# EAGLE design brelok (EAGLE 8.3.2)
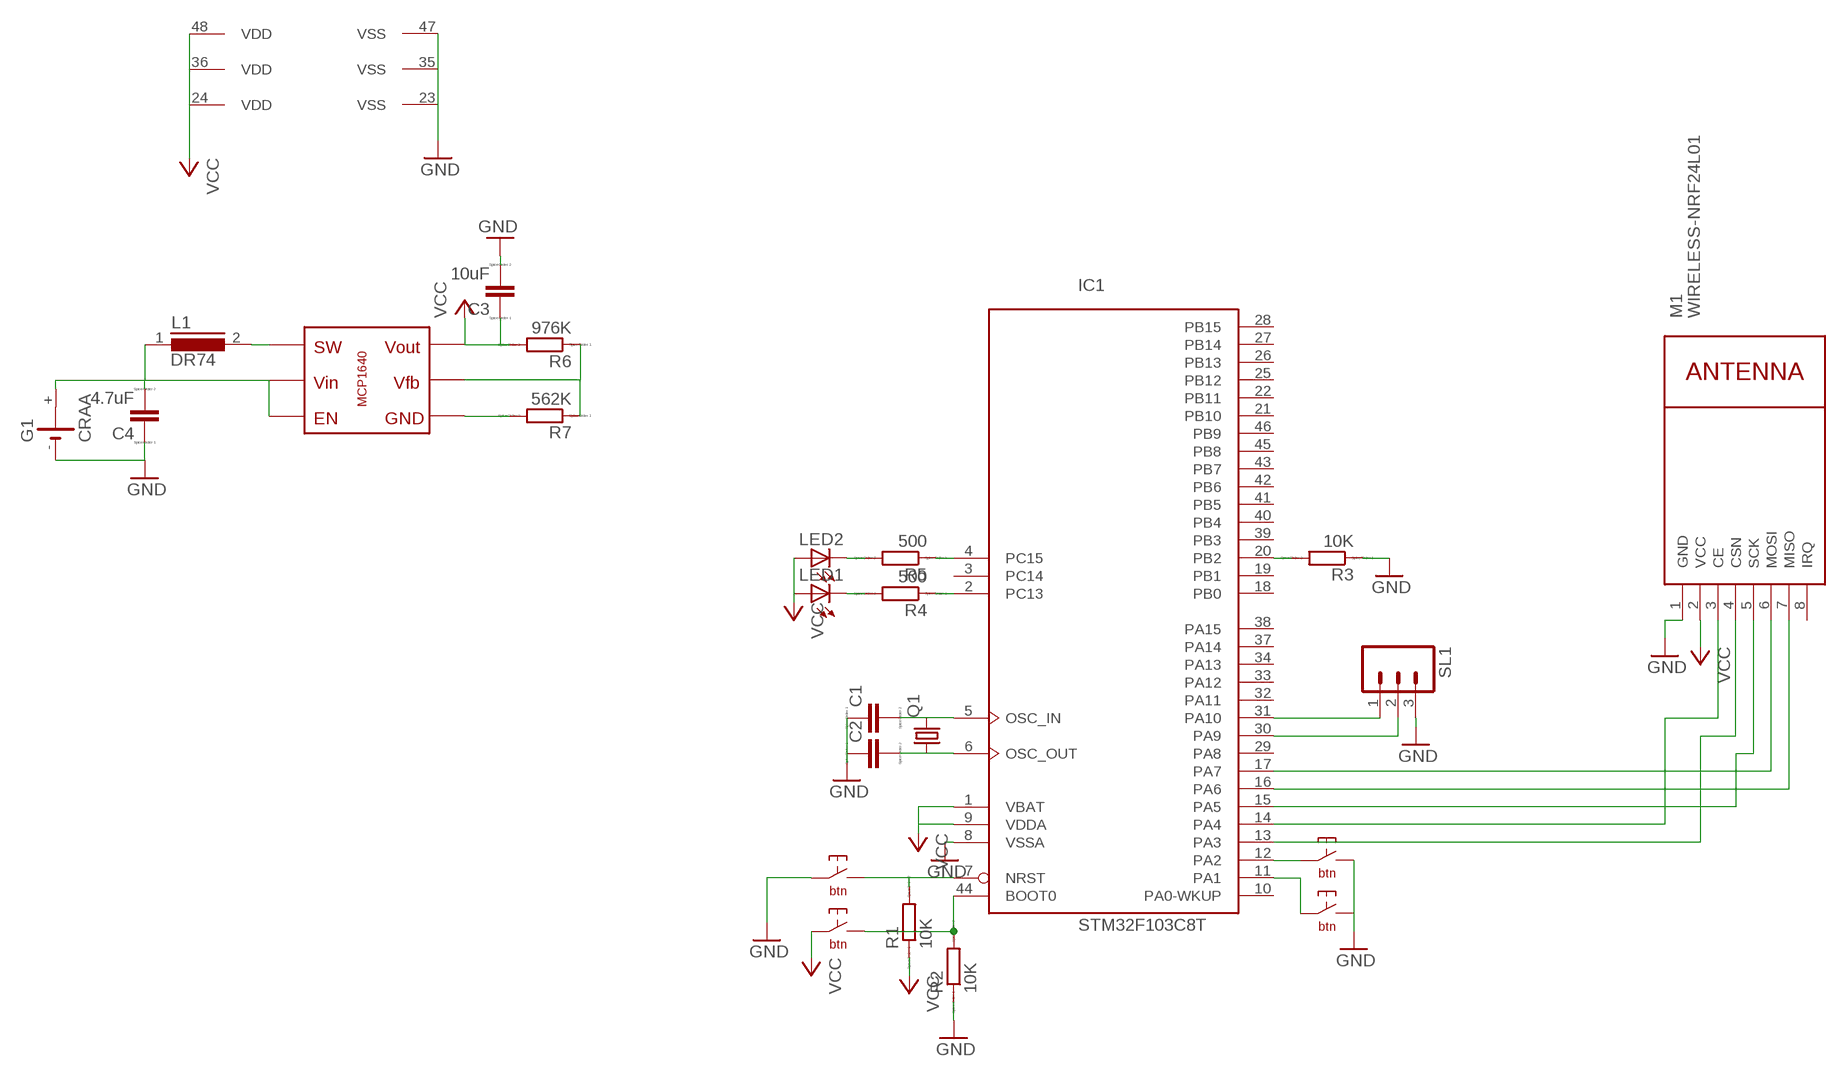
[diagram p0: schematic, sheet 1]

## Parts
BOOT  TM1103  [TM1103]
C1  CC0504  [C0504]
C2  CC0504  [C0504]
C3  10uF  CC0504  [C0504]
C4  4.7uF  CC0504  [C0504]
G1  CRAA  [CRAA]
IC1  STM32F103C8T  [LQFP48]
L1  DR74  [DR74]
LED1  LEDCHIP-LED0805  [CHIP-LED0805]
LED2  LEDCHIP-LED0805  [CHIP-LED0805]
M1  WIRELESS-NRF24L01  [WIRELESS-NRF24L01]
Q1  CRYSTALHC49UP  [HC49UP]
R1  10K  R  [R0805]
R2  10K  R  [R0805]
R3  10K  R  [R0805]
R4  500  R  [R0805]
R5  500  R  [R0805]
R6  976K  R  [R0805]
R7  562K  R  [R0805]
RESET  TM1103  [TM1103]
RESET1  TM1103  [TM1103]
RESET2  TM1103  [TM1103]
SL1  M03  [03P]
U$1  MCP1640  [SOT23-6]

## Nets
GND: C1.1 C2.1 C3.2 C4.1 G1.- IC1.8(VSSA) IC1.23(VSS) IC1.35(VSS) IC1.47(VSS) M1.1(GND) R2.1 R3.1 RESET1.P$1 RESET2.P$1 RESET.P$2 SL1.3
N$1: IC1.17(PA7) M1.6(MOSI)
N$2: IC1.16(PA6) M1.7(MISO)
N$3: IC1.15(PA5) M1.5(SCK)
N$4: IC1.14(PA4) M1.3(CE)
N$5: IC1.13(PA3) M1.4(CSN)
N$6: C1.2 IC1.5(OSC_IN) Q1.2
N$7: C2.2 IC1.6(OSC_OUT) Q1.1
N$8: IC1.7(NRST) R1.2 RESET.P$1
N$9: BOOT.P$1 IC1.44(BOOT0) R2.2
N$10: IC1.31(PA10) SL1.1
N$11: IC1.20(PB2) R3.2
N$12: IC1.30(PA9) SL1.2
N$13: LED1.C R4.2
N$14: LED2.C R5.2
N$15: IC1.4(PC15) R5.1
N$16: IC1.2(PC13) R4.1
N$17: L1.2 U$1.1(SW)
N$18: IC1.12(PA2) RESET1.P$2
N$19: IC1.11(PA1) RESET2.P$2
N$20: C4.2 G1.+ L1.1 U$1.3(EN) U$1.6(VIN)
N$22: C3.1 R6.2 U$1.5(VOUT)
N$23: R6.1 R7.1 U$1.4(VFB)
N$24: R7.2 U$1.2(GND)
VCC: BOOT.P$2 IC1.1(VBAT) IC1.9(VDDA) IC1.24(VDD) IC1.36(VDD) IC1.48(VDD) LED1.A LED2.A M1.2(VCC) R1.1
Unconnected: G1.+@1(+) IC1.3(PC14) IC1.10(PA0-WKUP) IC1.18(PB0) IC1.19(PB1) IC1.21(PB10) IC1.22(PB11) IC1.25(PB12) IC1.26(PB13) IC1.27(PB14) IC1.28(PB15) IC1.29(PA8) IC1.32(PA11) IC1.33(PA12) IC1.34(PA13) IC1.37(PA14) IC1.38(PA15) IC1.39(PB3) IC1.40(PB4) IC1.41(PB5) IC1.42(PB6) IC1.43(PB7) IC1.45(PB8) IC1.46(PB9) M1.8(IRQ)

## Library data of the parts
BOOT RESET RESET1 RESET2 = tm1103:TM1103
C1-C4 = eagle-ltspice:C: CAPACITOR, European symbol; SPICEMODEL: NONE; SPICEPREFIX: C
G1 = battery:CRAA: LI BATTERY Varta
IC1 = micro-stm_v2:STM32F103C*T: ARM 32-bit Cortex™-M3 CPU 72 MHz maximum frequency 16 to 128 Kbytes of Flash memory 6 to 20 kbytes of SRAM 37 GPIOs 2.0 to 3.6 V application supply
L1 = inductors:DR74: High Power Density, High Efficiency, Shielded Inductors Source: coiltronics_dr_series.pdf
LED1 LED2 = led:LED: LED OSRAM: - CHIPLED LG R971, LG N971, LY N971, LG Q971, LY Q971, LO R971, LY R971 LH N974, LH R974 LS Q976, LO Q976, LY Q976 LO Q996 - Hyper CHIPLED LW Q18S LB Q993, LB Q99A, LB R99A - SideLED LS A670, LO A670, LY A670, LG A670, LP A670 LB A673, LV A673, LT A673, LW A673 LH A674 LY A675 LS A676, LA A676, LO A676, LY A676, LW A676 LS A679, LY A679, LG A679 - Hyper Micro SIDELED® LS Y876, LA Y876, LO Y876, LY Y876 LT Y87S - SmartLED LW L88C, LW L88S LB L89C, LB L89S, LG L890 LS L89K, LO L89K, LY L89K LS L896, LA L896, LO L896, LY L896 - TOPLED LS T670, LO T670, LY T670, LG T670, LP T670 LSG T670, LSP T670, LSY T670, LOP T670, LYG T670 LG T671, LOG T671, LSG T671 LB T673, LV T673, LT T673, LW T673 LH T674 LS T676, LA T676, LO T676, LY T676, LB T676, LH T676, LSB T676, LW T676 LB T67C, LV T67C, LT T67C, LS T67K, LO T67K, LY T67K, LW E67C LS E67B, LA E67B, LO E67B, LY E67B, LB E67C, LV E67C, LT E67C LW T67C LS T679, LY T679, LG T679 LS T770, LO T770, LY T770, LG T770, LP T770 LB T773, LV T773, LT T773, LW T773 LH T774 LS E675, LA E675, LY E675, LS T675 LS T776, LA T776, LO T776, LY T776, LB T776 LHGB T686 LT T68C, LB T68C - Hyper Mini TOPLED® LB M676 - Mini TOPLED Santana® LG M470 LS M47K, LO M47K, LY M47K Source: http://www.osram.convergy.de LUXEON: - LUMILED® LXK2-PW12-R00, LXK2-PW12-S00, LXK2-PW14-U00, LXK2-PW14-V00 LXK2-PM12-R00, LXK2-PM12-S00, LXK2-PM14-U00 LXK2-PE12-Q00, LXK2-PE12-R00, LXK2-PE12-S00, LXK2-PE14-T00, LXK2-PE14-U00 LXK2-PB12-K00, LXK2-PB12-L00, LXK2-PB12-M00, LXK2-PB14-N00, LXK2-PB14-P00, LXK2-PB14-Q00 LXK2-PR12-L00, LXK2-PR12-M00, LXK2-PR14-Q00, LXK2-PR14-R00 LXK2-PD12-Q00, LXK2-PD12-R00, LXK2-PD12-S00 LXK2-PH12-R00, LXK2-PH12-S00 LXK2-PL12-P00, LXK2-PL12-Q00, LXK2-PL12-R00 Source: www.luxeon.com KINGBRIGHT: KA-3528ASYC Source: www.kingbright.com
M1 = diy-modules:WIRELESS-NRF24L01: 2.4 GHz Wireless Module based on NRF24L01 chip More details available here: http://www.electrodragon.com/w/NRF24L01 Click here to find device on ebay.com <http://www.ebay.com/sch/nrf24l01+arduino>
Q1 = crystal:CRYSTAL: CRYSTAL; OC_FARNELL: unknown; OC_NEWARK: unknown
R1-R7 = eagle-ltspice:R: RESISTOR, European symbol; SPICEMODEL: NONE; SPICEPREFIX: R
SL1 = con-amp-quick:M03: AMP QUICK CONNECTOR; OC_FARNELL: unknown; OC_NEWARK: unknown
U$1 = mcp1640:MCP1640

## Board
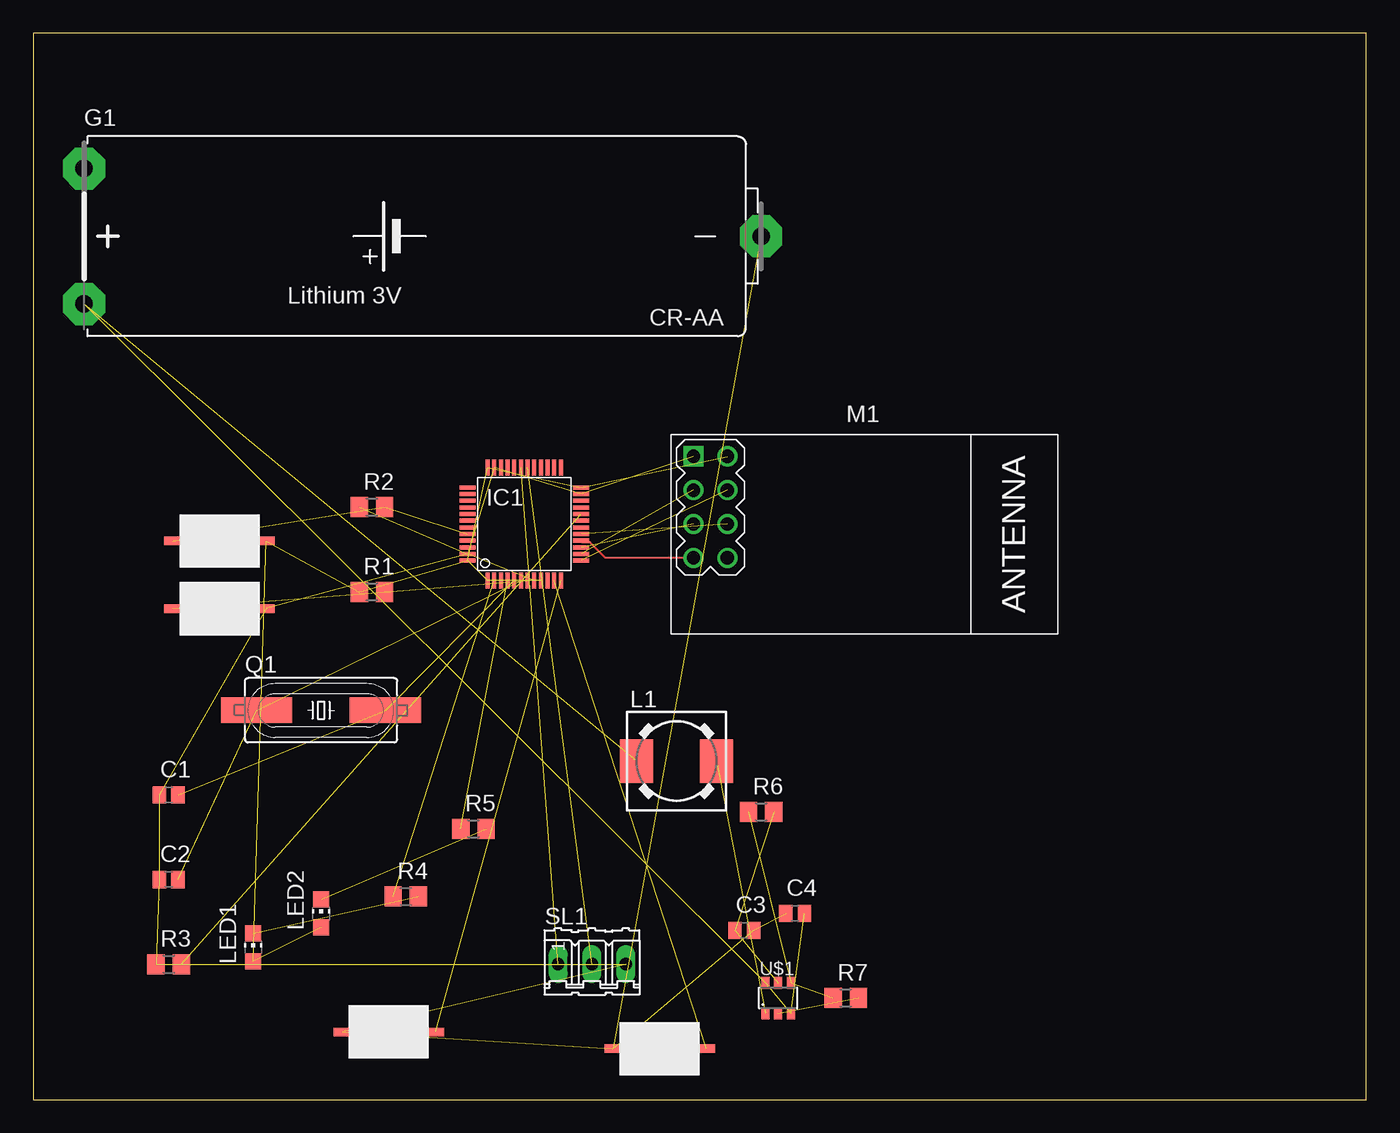
[diagram p1: board, top side]

Size 100 x 80 mm. Coordinates in mm from the lower left corner, seen from the top.
Outline: 0,0 100,0 100,80 0,80 0,0
Copper layers (1*16): Top 0.035mm / dielectric 1.5mm / Bottom 0.035mm
Design rules "default": minimum track width 6mil, minimum drill 0.35mm, track to track 6mil, track to pad 6mil, pad to pad 6mil, via to via 6mil, smd to smd 6mil, copper to edge 40mil, drill to drill 6mil, minimum pad ring 10mil, minimum via ring 8mil, stop-mask expansion 4mil, vias tented up to drill 0mil, thermal gap 10mil

### Footprints (pad centres in the part's own frame; a part is rotated, then mirrored left to right if it is on the bottom)
TM1103 = smd 1.27 x 0.635: P$1 -3.5,0; P$2 3.5,0
C0504 = smd 1 x 1.3: 1 -0.7,0; 2 0.7,0
CRAA = drill 1.321 pad 3.15 octagon: + -25.4,-5.08; +@1 -25.4,5.08; - 25.4,0
LQFP48 = smd 0.3 x 1.2: 1 -2.75,-4.25; 2 -2.25,-4.25; 3 -1.75,-4.25; 4 -1.25,-4.25; 5 -0.75,-4.25; 6 -0.25,-4.25; 7 0.25,-4.25; 8 0.75,-4.25; 9 1.25,-4.25; 10 1.75,-4.25; 11 2.25,-4.25; 12 2.75,-4.25; 25 2.75,4.25; 26 2.25,4.25; 27 1.75,4.25; 28 1.25,4.25; 29 0.75,4.25; 30 0.25,4.25; 31 -0.25,4.25; 32 -0.75,4.25; 33 -1.25,4.25; 34 -1.75,4.25; 35 -2.25,4.25; 36 -2.75,4.25 | smd 1.2 x 0.3: 13 4.25,-2.75; 14 4.25,-2.25; 15 4.25,-1.75; 16 4.25,-1.25; 17 4.25,-0.75; 18 4.25,-0.25; 19 4.25,0.25; 20 4.25,0.75; 21 4.25,1.25; 22 4.25,1.75; 23 4.25,2.25; 24 4.25,2.75; 37 -4.25,2.75; 38 -4.25,2.25; 39 -4.25,1.75; 40 -4.25,1.25; 41 -4.25,0.75; 42 -4.25,0.25; 43 -4.25,-0.25; 44 -4.25,-0.75; 45 -4.25,-1.25; 46 -4.25,-1.75; 47 -4.25,-2.25; 48 -4.25,-2.75
DR74 = smd 2.5 x 3.25: 1 -3,0; 2 3,0
CHIP-LED0805 = smd 1.2 x 1.2: A 0,-1.05; C 0,1.05
WIRELESS-NRF24L01 = drill 1 square: 1 -12.7,6.35 | drill 1: 2 -10.16,6.35; 3 -12.7,3.81; 4 -10.16,3.81; 5 -12.7,1.27; 6 -10.16,1.27; 7 -12.7,-1.27; 8 -10.16,-1.27
HC49UP = smd 5.334 x 1.93: 1 -4.826,0; 2 4.826,0
R0805 = smd 1.3 x 1.5: 1 -0.95,0; 2 0.95,0
03P = drill 0.914 long: 1 -2.54,0; 2 0,0; 3 2.54,0
SOT23-6 = smd 0.6 x 0.9: 1 -0.95,-1.15; 2 0,-1.15; 3 0.95,-1.15; 4 0.95,1.15; 5 0,1.15; 6 -0.95,1.15

### Placement (x,y rotation side)
BOOT  13.97,41.91 0 top
C1  10.16,22.86 0 top
C2  10.16,16.51 0 top
C3  53.34,12.7 0 top
C4  57.15,13.97 0 top
G1  29.21,64.77 0 top
IC1  36.83,43.18 0 top
L1  48.26,25.4 0 top
LED1  16.51,11.43 0 top
LED2  21.59,13.97 0 top
M1  62.23,41.91 0 top
Q1  21.59,29.21 0 top
R1  25.4,38.1 0 top
R2  25.4,44.45 0 top
R3  10.16,10.16 0 top
R4  27.94,15.24 0 top
R5  33.02,20.32 0 top
R6  54.61,21.59 0 top
R7  60.96,7.62 0 top
RESET  13.97,36.83 0 top
RESET1  26.67,5.08 0 top
RESET2  46.99,3.81 0 top
SL1  41.91,10.16 0 top
U$1  55.88,7.62 0 top

### Tracks (layer width: path | path; a pad name or v marks a point on that pad's centre or on a via)
GND  (15 unrouted)
N$1  (1 unrouted)
N$2
  Top 0.152: IC1.16 41.2,41.81 41.77,41.81 42.94,40.64 M1.7
N$3  (1 unrouted)
N$4  (1 unrouted)
N$5  (1 unrouted)
N$6  (2 unrouted)
N$7  (2 unrouted)
N$8  (2 unrouted)
N$9  (2 unrouted)
N$10  (1 unrouted)
N$11  (1 unrouted)
N$12  (1 unrouted)
N$13  (1 unrouted)
N$14  (1 unrouted)
N$15  (1 unrouted)
N$16  (1 unrouted)
N$17  (1 unrouted)
N$18  (1 unrouted)
N$19  (1 unrouted)
N$20  (4 unrouted)
N$22  (2 unrouted)
N$23  (2 unrouted)
N$24  (1 unrouted)
VCC  (9 unrouted)